# EAGLE design lightmeter_5_ATTiny84 (EAGLE 9.6.2)
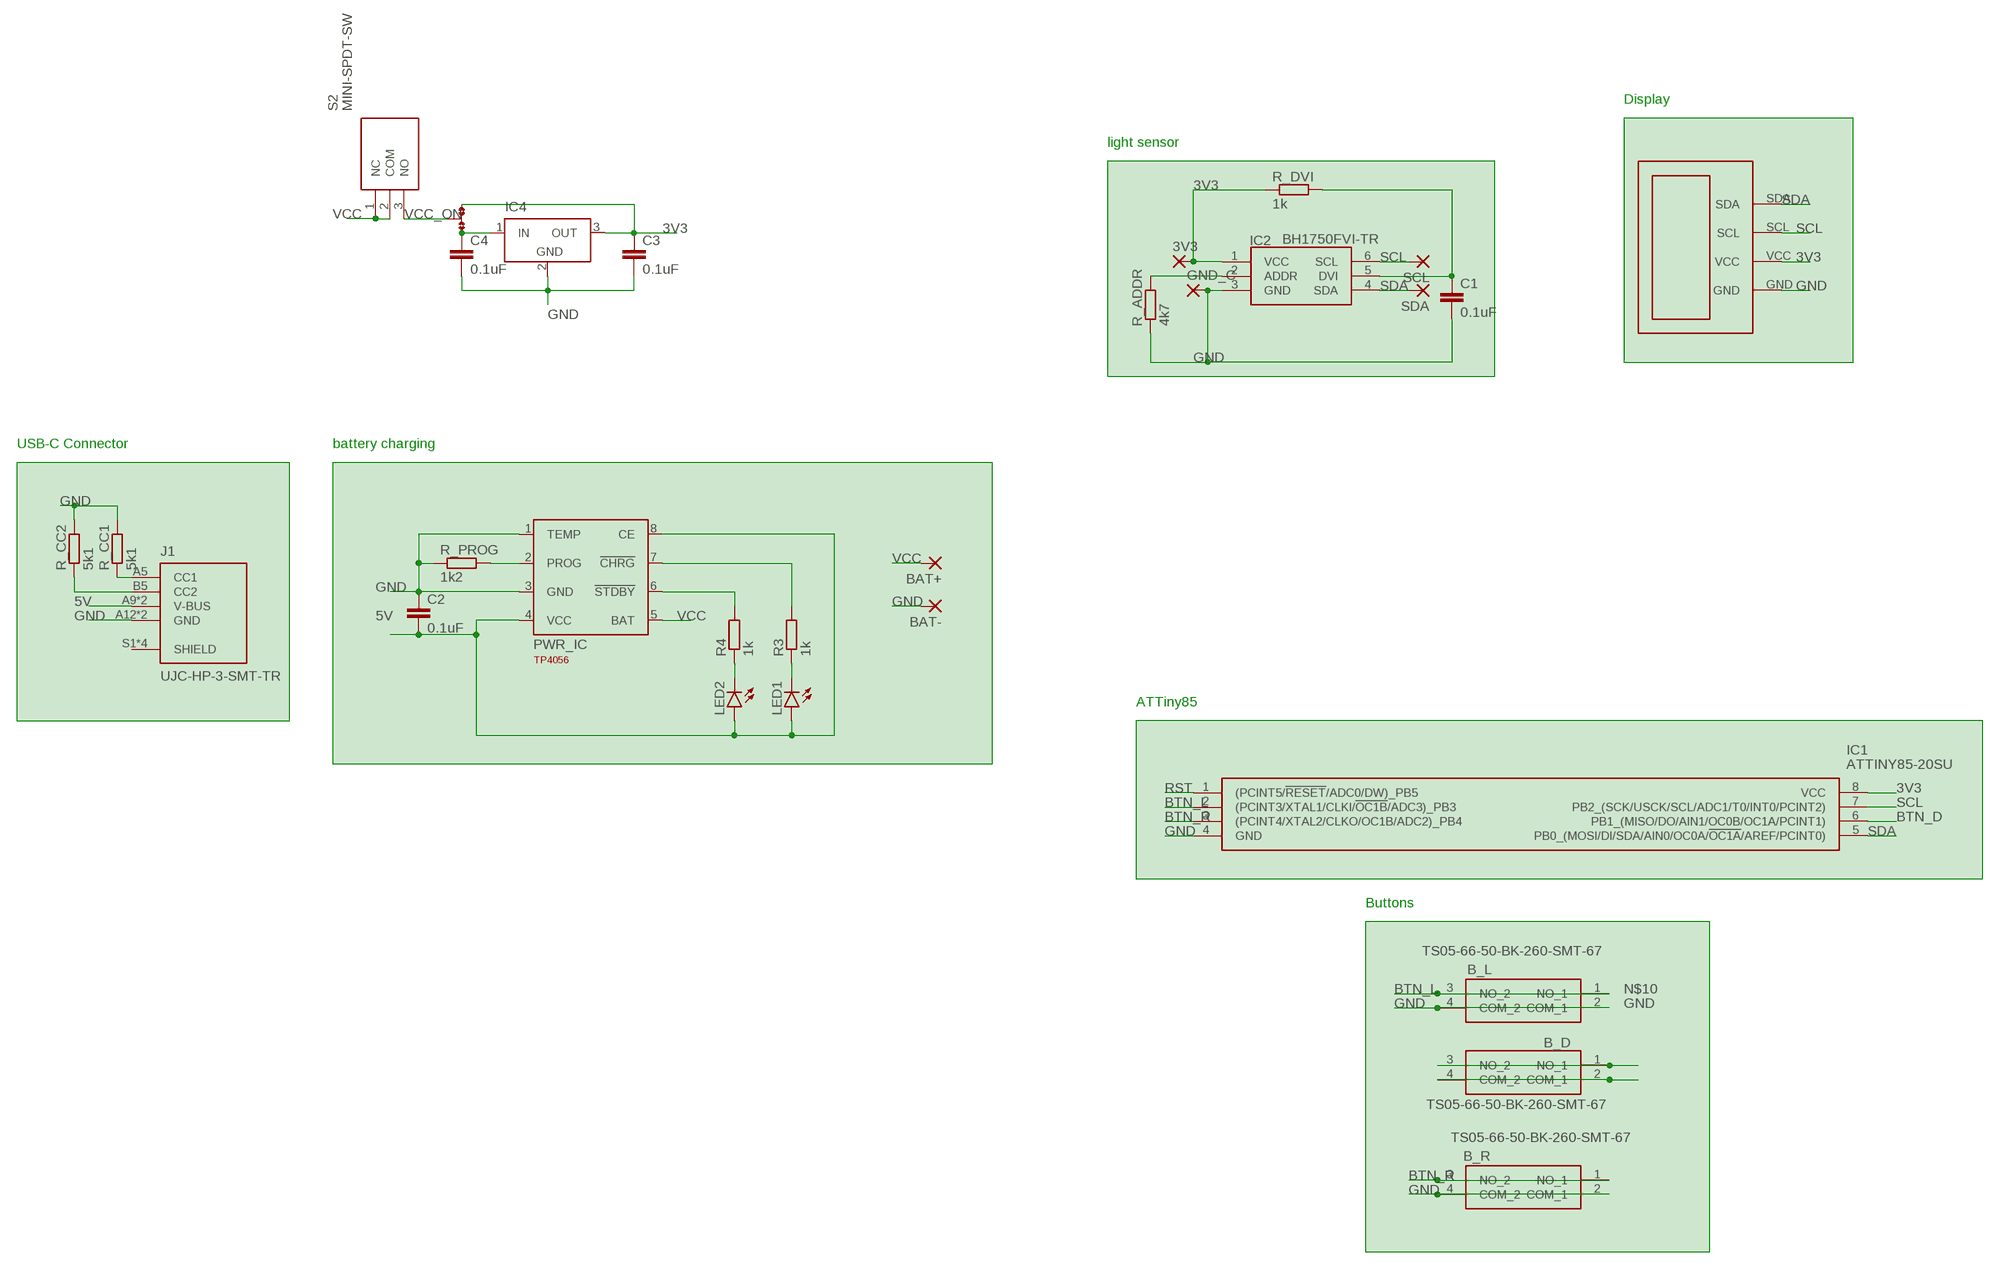
[diagram p0: schematic, sheet 1]

## Parts
3V3  1,6/0,8  [1,6/0,8]
B_D  TS05-66-50-BK-260-SMT-67  [TS056650BK260SMT67]
B_L  TS05-66-50-BK-260-SMT-67  [TS056650BK260SMT67]
B_R  TS05-66-50-BK-260-SMT-67  [TS056650BK260SMT67]
BAT+  WIREPADSMD1,27-254  [SMD1,27-2,54]
BAT-  WIREPADSMD1,27-254  [SMD1,27-2,54]
C1  0.1uF  C-EUC0805K  [C0805K]
C2  0.1uF  C-EUC0805K  [C0805K]
C3  0.1uF  C-EUC0805K  [C0805K]
C4  0.1uF  C-EUC0805K  [C0805K]
GND_C  1,6/0,8  [1,6/0,8]
IC1  ATTINY85-20SU  [SOIC127P798X216-8N]
IC2  BH1750FVI-TR  [WSOF6]
IC4  LT1129CST5  [SOT223]
J1  UJC-HP-3-SMT-TR  [CUI_UJC-HP-3-SMT-TR]
JMP1  0R-JUMPB  [B0R-JMP]
LED1  LEDCHIPLED_1206  [CHIPLED_1206]
LED2  LEDCHIPLED_1206  [CHIPLED_1206]
PWR_IC  TP4056  [SOT23-8]
R3  1k  R-EU_R0805  [R0805]
R4  1k  R-EU_R0805  [R0805]
R_ADDR  4k7  R-EU_R0805  [R0805]
R_CC1  5k1  R-EU_R0805  [R0805]
R_CC2  5k1  R-EU_R0805  [R0805]
R_DVI  1k  R-EU_R0805  [R0805]
R_PROG  1k2  R-EU_R0805  [R0805]
S2  MINI-SPDT-SW  [MINISPDTSW]
SCL  1,6/0,8  [1,6/0,8]
SDA  1,6/0,8  [1,6/0,8]
U$1  I2C_OLED_128X64  [I2C_OLED_128X64_BREAKOUT]

## Nets
3V3: 3V3.1(P) C3.1 IC1.8(VCC) IC2.1(VCC) IC4.3(OUT) JMP1.3 R_DVI.1 U$1.VCC
5V: C2.2 J1.A9(V-BUS) J1.B9(V-BUS) LED1.A LED2.A PWR_IC.4(VCC) PWR_IC.8(CE)
BTN_D: IC1.6(PB1_(MISO/DO/AIN1/OC0B/OC1A/PCINT1))
BTN_L: B_L.1(NO_1) B_L.3(NO_2) IC1.2((PCINT3/XTAL1/CLKI/!OC1B!/ADC3)_PB3)
BTN_R: B_R.1(NO_1) B_R.3(NO_2) IC1.3((PCINT4/XTAL2/CLKO/OC1B/ADC2)_PB4)
GND: B_D.2(COM_1) B_D.4(COM_2) B_L.2(COM_1) B_L.4(COM_2) B_R.2(COM_1) B_R.4(COM_2) BAT-.1(P) C1.2 C2.1 C3.2 C4.2 GND_C.1(P) IC1.4(GND) IC2.3(GND) IC4.2(GND) J1.A12(GND) J1.B12(GND) PWR_IC.1(TEMP) PWR_IC.3(GND) R_ADDR.1 R_CC1.2 R_CC2.2 R_PROG.1 U$1.GND
N$1: C1.1 IC2.5(DVI) R_DVI.2
N$2: IC2.2(ADDR) R_ADDR.2
N$3: J1.B5(CC2) R_CC2.1
N$4: PWR_IC.6(!STDBY) R4.2
N$5: PWR_IC.7(!CHRG) R3.2
N$6: LED2.C R4.1
N$7: LED1.C R3.1
N$8: J1.A5(CC1) R_CC1.1
N$9: PWR_IC.2(PROG) R_PROG.2
N$10: B_D.1(NO_1) B_D.3(NO_2)
N$11: C4.1 IC4.1(IN) JMP1.1
RST: IC1.1((PCINT5/!RESET!/ADC0/DW)_PB5)
SCL: IC1.7(PB2_(SCK/USCK/SCL/ADC1/T0/INT0/PCINT2)) IC2.6(SCL) SCL.1(P) U$1.SCL
SDA: IC1.5(PB0_(MOSI/DI/SDA/AIN0/OC0A/!OC1A!/AREF/PCINT0)) IC2.4(SDA) SDA.1(P) U$1.SDA
VCC: BAT+.1(P) PWR_IC.5(BAT) S2.1(NC) S2.2(COM)
VCC_ON: JMP1.2 S2.3(NO)
Unconnected: J1.S1(SHIELD) J1.S2(SHIELD) J1.S3(SHIELD) J1.S4(SHIELD)

## Notes on the sheet
- Display
- light sensor
- USB-C Connector | battery charging
- ATTiny85
- Buttons

## Power pins joined to a net without a drawn wire
GND: IC4.4(GND)

## Library data of the parts
3V3 GND_C SCL SDA = wirepad:1,6/0,8: THROUGH-HOLE PAD
B_D B_L B_R = SamacSys_Parts:TS05-66-50-BK-260-SMT-67: Tactile Switches 6 x 6 mm, 5 mm Act Height, 260 gf, Black, Surface Mount, IP67, SPST, Source: Datasheet <https://www.cuidevices.com/product/resource/ts05.pdf>; DESCRIPTION: Tactile Switches 6 x 6 mm, 5 mm Act Height, 260 gf, Black, Surface Mount, IP67, SPST,; HEIGHT: 5.2mm; MANUFACTURER_NAME: CUI Inc.; MANUFACTURER_PART_NUMBER: TS05-66-50-BK-260-SMT-67; MOUSER_PART_NUMBER: 179-TS056650260SMT67; MOUSER_PRICE-STOCK: https://www.mouser.co.uk/ProductDetail/CUI-Devices/TS05-66-50-BK-260-SMT-67?qs=A6eO%252BMLsxmTTpMlvA87NHQ%3D%3D
BAT+ BAT- = wirepad:WIREPAD: Wire PAD connect wire on PCB
C1-C4 = rcl:C-EU: CAPACITOR, European symbol; SPICEPREFIX: C
IC1 = SamacSys_Parts:ATTINY85-20SU: MICROCHIP - ATTINY85-20SU - MICROCONTROLLER MCU, 8 BIT, ATTINY, 20MHZ, SOIC-8 Source: Datasheet <https://componentsearchengine.com/Datasheets/2/ATTINY85-20SU.pdf>; DESCRIPTION: MICROCHIP - ATTINY85-20SU - MICROCONTROLLER MCU, 8 BIT, ATTINY, 20MHZ, SOIC-8; HEIGHT: 2.16mm; MANUFACTURER_NAME: Microchip; MANUFACTURER_PART_NUMBER: ATTINY85-20SU; MOUSER_PART_NUMBER: 556-ATTINY85-20SU; MOUSER_PRICE-STOCK: https://www.mouser.co.uk/ProductDetail/Microchip-Technology-Atmel/ATTINY85-20SU?qs=8jWQYweyg6N%2FGXnwAe4Icw%3D%3D
IC2 = SamacSys_Parts:BH1750FVI-TR: Ambient Light Sensor,16bit,I2C,WSOF6I ROHM BH1750FVI-TR Ambient Light Sensor Unit Surface Mount Source: Datasheet <https://componentsearchengine.com/Datasheets/2/BH1750FVI-TR.pdf>; DESCRIPTION: Ambient Light Sensor,16bit,I2C,WSOF6I ROHM BH1750FVI-TR Ambient Light Sensor Unit Surface Mount; HEIGHT: mm; MANUFACTURER_NAME: ROHM Semiconductor; MANUFACTURER_PART_NUMBER: BH1750FVI-TR; MOUSER_PART_NUMBER: 755-BH1750FVI-TR; MOUSER_PRICE-STOCK: https://www.mouser.co.uk/ProductDetail/ROHM-Semiconductor/BH1750FVI-TR?qs=phc6PQ%252BTPUNy88lRCs6mVA%3D%3D
IC4 = linear-technology:LT1129CST5: VOLTAGE REGULATOR with shutdown; MPN: LT1129CST-5#PBF; OC_FARNELL: 1663375; OC_NEWARK: 57M2069
J1 = UJC-HP-3-SMT-TR:UJC-HP-3-SMT-TR: Type C, 3 A, Right Angle, Surface Mount (SMT), Power-Only USB Receptacle Check availability <https://pricing.snapeda.com/parts/UJC-HP-3-SMT-TR/CUI%20Devices/view-part?ref=eda>; AVAILABILITY: In Stock; CUI_PURCHASE_URL: https://www.cuidevices.com/product/interconnect/connectors/usb-connectors/ujc-hp-3-smt-tr?utm_source=snapeda.com&utm_medium=referral&utm_campaign=snapedaBOM; DESCRIPTION: Type C, 3 A, Right Angle, Surface Mount (SMT), Power-Only USB Receptacle; MF: CUI Devices; MP: UJC-HP-3-SMT-TR; PACKAGE: None; PRICE: None; PURCHASE-URL: https://pricing.snapeda.com/search/part/UJC-HP-3-SMT-TR/?ref=eda
JMP1 = jump-0r-smd:0R-JUMP: SMD 0R 0805 Jumper
LED1 LED2 = led:LED: LED OSRAM: - CHIPLED LG R971, LG N971, LY N971, LG Q971, LY Q971, LO R971, LY R971 LH N974, LH R974 LS Q976, LO Q976, LY Q976 LO Q996 - Hyper CHIPLED LW Q18S LB Q993, LB Q99A, LB R99A - SideLED LS A670, LO A670, LY A670, LG A670, LP A670 LB A673, LV A673, LT A673, LW A673 LH A674 LY A675 LS A676, LA A676, LO A676, LY A676, LW A676 LS A679, LY A679, LG A679 - Hyper Micro SIDELED® LS Y876, LA Y876, LO Y876, LY Y876 LT Y87S - SmartLED LW L88C, LW L88S LB L89C, LB L89S, LG L890 LS L89K, LO L89K, LY L89K LS L896, LA L896, LO L896, LY L896 - TOPLED LS T670, LO T670, LY T670, LG T670, LP T670 LSG T670, LSP T670, LSY T670, LOP T670, LYG T670 LG T671, LOG T671, LSG T671 LB T673, LV T673, LT T673, LW T673 LH T674 LS T676, LA T676, LO T676, LY T676, LB T676, LH T676, LSB T676, LW T676 LB T67C, LV T67C, LT T67C, LS T67K, LO T67K, LY T67K, LW E67C LS E67B, LA E67B, LO E67B, LY E67B, LB E67C, LV E67C, LT E67C LW T67C LS T679, LY T679, LG T679 LS T770, LO T770, LY T770, LG T770, LP T770 LB T773, LV T773, LT T773, LW T773 LH T774 LS E675, LA E675, LY E675, LS T675 LS T776, LA T776, LO T776, LY T776, LB T776 LHGB T686 LT T68C, LB T68C - Hyper Mini TOPLED® LB M676 - Mini TOPLED Santana® LG M470 LS M47K, LO M47K, LY M47K Source: http://www.osram.convergy.de LUXEON: - LUMILED® LXK2-PW12-R00, LXK2-PW12-S00, LXK2-PW14-U00, LXK2-PW14-V00 LXK2-PM12-R00, LXK2-PM12-S00, LXK2-PM14-U00 LXK2-PE12-Q00, LXK2-PE12-R00, LXK2-PE12-S00, LXK2-PE14-T00, LXK2-PE14-U00 LXK2-PB12-K00, LXK2-PB12-L00, LXK2-PB12-M00, LXK2-PB14-N00, LXK2-PB14-P00, LXK2-PB14-Q00 LXK2-PR12-L00, LXK2-PR12-M00, LXK2-PR14-Q00, LXK2-PR14-R00 LXK2-PD12-Q00, LXK2-PD12-R00, LXK2-PD12-S00 LXK2-PH12-R00, LXK2-PH12-S00 LXK2-PL12-P00, LXK2-PL12-Q00, LXK2-PL12-R00 Source: www.luxeon.com KINGBRIGHT: KA-3528ASYC Source: www.kingbright.com
PWR_IC = tp4056:TP4056: TP4056 Data sheet <http://goo.gl/J7k8TF> Dave.Calaway Eagle Library <https://goo.gl/Muy1Tr>
R3 R4 R_ADDR R_CC1 R_CC2 R_DVI R_PROG = rcl:R-EU_: RESISTOR, European symbol; SPICEPREFIX: R
S2 = SamacSys_Parts:MINI-SPDT-SW: Slide Switches MINI SPDT SWITCH Source: Datasheet <http://site.gravitech.us/Components/MINI-SPDT-SW/EG1218_datasheet.pdf>; DESCRIPTION: Slide Switches MINI SPDT SWITCH; HEIGHT: mm; MANUFACTURER_NAME: Gravitech; MANUFACTURER_PART_NUMBER: MINI-SPDT-SW; MOUSER_PART_NUMBER: 992-MINI-SPDT-SW; MOUSER_PRICE-STOCK: https://www.mouser.co.uk/ProductDetail/Gravitech/MINI-SPDT-SW?qs=Vxac6xGyzPm8ENq695r3yA%3D%3D
U$1 = my_breakouts:I2C_OLED_128X64

## Board
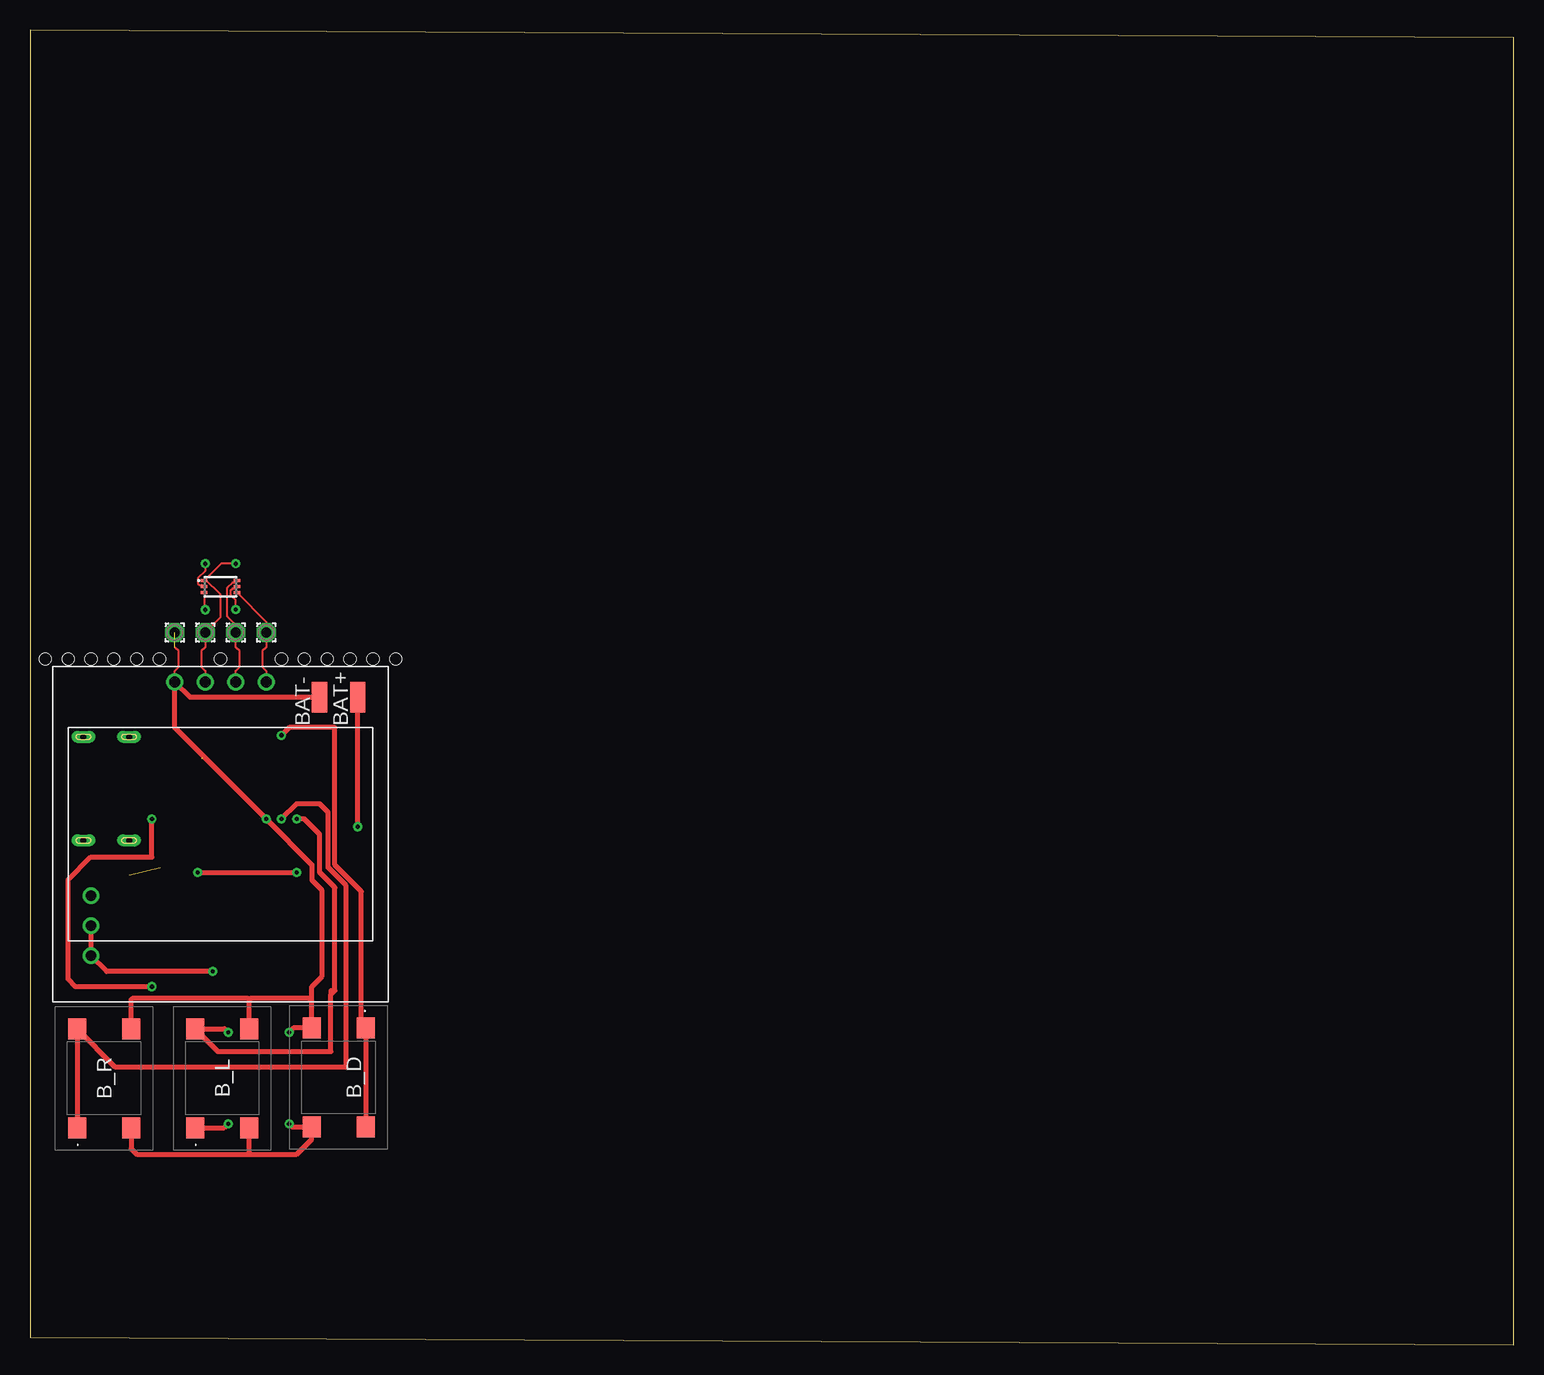
[diagram p1: board, top side]
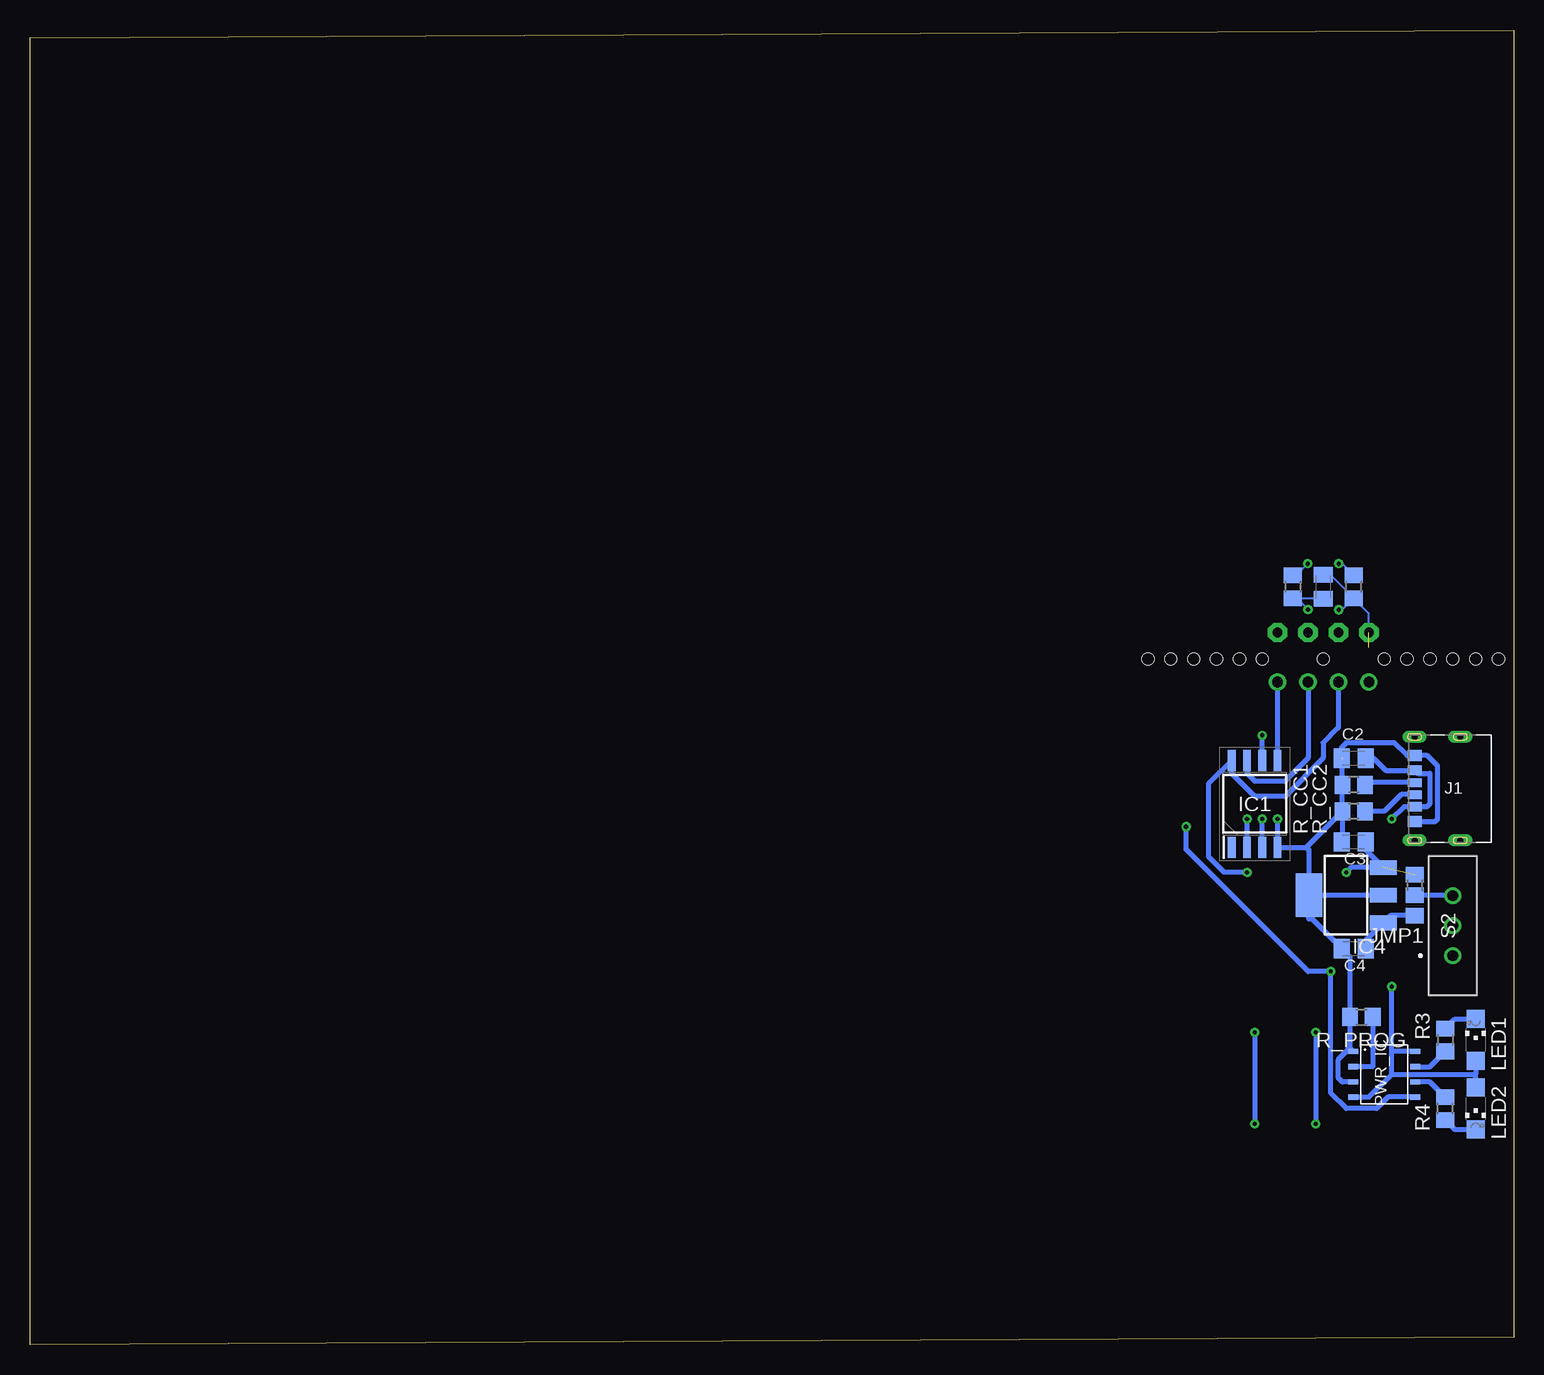
[diagram p2: board, bottom side, seen from below]

Size 123.64 x 109.59 mm. Coordinates in mm from the lower left corner, seen from the top.
Outline: 0,0.64 123.64,0 123.64,108.96 0,109.59 0,0.64
Copper layers (1*16): Top 0.035mm / dielectric 1.5mm / Bottom 0.035mm
Design rules "default": minimum track width 6mil, minimum drill 0.35mm, track to track 6mil, track to pad 6mil, pad to pad 6mil, via to via 6mil, smd to smd 6mil, copper to edge 40mil, drill to drill 6mil, minimum pad ring 10mil, minimum via ring 8mil, stop-mask expansion 4mil, vias tented up to drill 0mil, thermal gap 10mil
Holes 1 mm at 1.27,57.15 3.17,57.15 5.08,57.15 6.99,57.15 8.89,57.15 10.79,57.15 15.88,57.15 20.96,57.15 22.86,57.15 24.77,57.15 26.67,57.15 28.58,57.15 30.48,57.15

### Footprints (pad centres in the part's own frame; a part is rotated, then mirrored left to right if it is on the bottom)
1,6/0,8 = drill 0.813 pad 1.6 octagon: 1 0,0
TS056650BK260SMT67 = smd 1.75 x 1.5: 1 -4.125,2.25; 2 -4.125,-2.25; 3 4.125,2.25; 4 4.125,-2.25
SMD1,27-2,54 = smd 1.27 x 2.54: 1 0,0
C0805K = smd 1.3 x 1.6: 1 -1,0; 2 1,0
SOIC127P798X216-8N = smd 1.75 x 0.65: 1 -3.625,1.905; 2 -3.625,0.635; 3 -3.625,-0.635; 4 -3.625,-1.905; 5 3.625,-1.905; 6 3.625,-0.635; 7 3.625,0.635; 8 3.625,1.905
WSOF6 = smd 0.55 x 0.25: 1 -1.375,0.5; 2 -1.375,0; 3 -1.375,-0.5; 4 1.375,-0.5; 5 1.375,0; 6 1.375,0.5
SOT223 = smd 1.219 x 2.235: 1 -2.311,-3.099; 2 0,-3.099; 3 2.311,-3.099 | smd 3.6 x 2.2: 4 0,3.099
CUI_UJC-HP-3-SMT-TR = smd 0.7 x 1.15: A5 -0.5,0.005; B5 0.5,0.005 | smd 0.8 x 1.15: A9 1.52,0.005; B9 -1.52,0.005 | smd 0.9 x 1.15: A12 2.75,0.005; B12 -2.75,0.005 | drill 0.5 pad 1 long: S1 -4.32,0; S2 4.32,0; S3 -4.32,-3.8; S4 4.32,-3.8
B0R-JMP = smd 1.5 x 1.3: 1 0,1.7; 2 0,0; 3 0,-1.7
CHIPLED_1206 = smd 1.5 x 1.5: A 0,-1.75; C 0,1.75
SOT23-8 = smd 0.42 x 0.835: 1 -1.905,-2.58; 2 -0.635,-2.58; 3 0.635,-2.58; 4 1.905,-2.58; 5 1.905,2.58; 6 0.635,2.58; 7 -0.635,2.58; 8 -1.905,2.58
R0805 = smd 1.3 x 1.5: 1 -0.95,0; 2 0.95,0
MINISPDTSW = drill 0.9 pad 1.4: 1 -2.5,0; 2 0,0; 3 2.5,0
I2C_OLED_128X64_BREAKOUT = drill 0.9 pad 1.422: GND -10.16,1.27; SCL -15.24,1.27; SDA -17.78,1.27; VCC -12.7,1.27

### Placement (x,y rotation side)
3V3  14.6,59.37 0 top
B_D  25.71,22.27 270 top
B_L  16.02,22.21 90 top
B_R  6.17,22.21 90 top
BAT+  27.3,53.97 0 top
BAT-  24.13,53.97 0 top
C1  15.88,63.18 90 bottom
C2  13.33,48.89 0 bottom
C3  13.33,41.91 180 bottom
C4  13.33,33.02 180 bottom
GND_C  12.06,59.37 0 top
IC1  21.59,45.09 90 bottom
IC2  15.88,63.18 0 top
IC4  13.97,37.46 90 bottom
J1  8.25,46.35 90 bottom
JMP1  8.25,37.46 180 bottom
LED1  3.17,25.4 0 bottom
LED2  3.17,19.69 180 bottom
PWR_IC  10.79,22.54 270 bottom
R3  5.71,25.4 270 bottom
R4  5.71,19.69 90 bottom
R_ADDR  13.33,63.18 90 bottom
R_CC1  13.33,44.45 180 bottom
R_CC2  13.33,46.67 180 bottom
R_DVI  18.42,63.18 270 bottom
R_PROG  12.7,27.3 0 bottom
S2  5.08,34.92 90 bottom
SCL  17.14,59.37 0 top
SDA  19.69,59.37 0 top
U$1  1.91,56.52 180 top

### Tracks (layer width: path | path; a pad name or v marks a point on that pad's centre or on a via)
3V3  (via drill 0.35)  (1 unrouted)
  Top 0.152: v17.16,65.1 15.92,65.1 14.62,63.8 | 14.62,63.8 IC2.1 | 14.62,63.8 14.62,63.79 15.83,62.57 15.83,60.6 3V3.1 14.6,58.13 14.28,57.81 14.28,56.49 14.6,56.17 U$1.VCC
  Top 0.406: v13.97,39.37 v22.23,39.37
  Bottom 0.152: R_DVI.1 18.12,64.13 v17.16,65.1
  Bottom 0.203: R_DVI.1 18.42,64.45
  Bottom 0.406: 14.6,54.61 U$1.VCC 14.6,51.43 15.88,50.16 15.88,48.89 19.05,45.72 21.59,45.72 23.5,47.62 IC1.8 25.4,46.8 25.4,40.64 24.13,39.37 v22.23,39.37 | C3.1 12.33,41.24 IC4.3 13.56,39.78 v13.97,39.37
5V  (via drill 0.35)
  Top 0.406: v10.16,29.85 3.81,29.85 3.17,30.48 3.17,38.73 5.08,40.64 10.16,40.64 v10.16,43.81
  Bottom 0.406: LED2.A 3.17,22.54 | LED1.A 3.17,22.54 | C2.2 11.7,48.89 10.68,47.88 J1.A9 8.01,47.62 6.99,47.62 6.99,45.09 7.24,44.84 J1.B9 9.14,44.84 v10.16,43.81 | 10.16,22.54 3.17,22.54 | 10.16,22.54 10.16,24.45 | PWR_IC.8 10.16,24.45 | PWR_IC.4 12.06,20.64 10.16,22.54 | 10.16,24.45 v10.16,29.85
BTN_D  (via drill 0.35)
  Top 0.406: v20.96,50.8 21.59,51.43 25.4,51.43 25.4,40 27.62,37.78 27.62,26.74
  Bottom 0.406: IC1.6 v20.96,50.8
BTN_L  (via drill 0.35)
  Top 0.406: 25.08,29.21 25.08,24.45 15.65,24.45 B_L.3 16.21,26.34 v16.51,26.04 | 25.08,29.53 25.08,29.21 | 25.08,29.21 25.4,29.53 25.4,38.1 24.13,39.37 24.13,42.54 22.86,43.81 v22.23,43.81 | B_L.1 16.18,18.09 v16.51,18.42
  Bottom 0.406: IC1.2 v22.23,43.81 | v16.51,26.04 v16.51,18.42
BTN_R  (via drill 0.35)
  Top 0.406: v20.96,43.81 22.23,45.09 24.13,45.09 24.84,44.37 24.84,39.77 26.35,38.26 26.35,23.18 7.08,23.18 B_R.3 B_R.1
  Bottom 0.406: IC1.3 v20.96,43.81
GND  (via drill 0.35)  (2 unrouted)
  Top 0.152: IC2.3 14.5,61.36 v14.59,61.27 | U$1.GND 12.06,56.17 12.39,56.49 12.39,57.81 12.06,58.13
  Top 0.406: B_R.4 8.42,28.74 8.57,28.89 18.1,28.89 18.27,28.72 | B_L.4 18.27,28.72 | 23.46,28.61 23.18,28.89 18.43,28.89 18.27,28.72 | 23.46,28.61 B_D.2 21.95,26.4 v21.59,26.04 | 23.46,28.61 23.46,29.81 24.31,30.66 24.31,37.92 23.5,38.73 23.5,40 v19.69,43.81 12.06,51.43 U$1.GND 13.33,53.97 BAT-.1 | B_R.2 8.42,16.34 8.89,15.87 18.42,15.87 | 18.42,15.87 22.23,15.87 23.46,17.11 B_D.4 21.86,18.15 v21.59,18.42 | 18.42,15.87 18.27,16.03 B_L.2
  Bottom 0.152: R_ADDR.1 15.29,64.18 C1.2 | GND_C.1 12.06,60.96 R_ADDR.1 | R_ADDR.1 14.3,61.27 v14.59,61.27
  Bottom 0.406: PWR_IC.1 13.65,24.72 | 13.65,24.72 R_PROG.1 13.65,32.34 C4.2 16.8,35.48 17.07,35.48 IC4.4 | PWR_IC.3 14.29,21.91 14.6,22.23 14.6,23.77 13.65,24.72 | J1.B12 8.33,43.53 | 8.15,43.5 J1.B12 | J1.B12 6.56,43.6 6.35,43.81 6.35,48.26 7.2,49.1 J1.A12 8.89,49.1 9.96,50.16 13.97,50.16 14.33,49.8 C2.1 | R_CC1.2 R_CC2.2 14.29,48.84 | v19.69,43.81 IC1.4 17.27,41.46 | v21.59,26.04 v21.59,18.42 | R_CC1.2 17.27,41.46 | 17.27,41.46 17.07,41.25 IC4.4 | IC4.2 IC4.4 | R_CC1.2 14.29,41.96 C3.2
N$1  (via drill 0.35)
  Top 0.152: v17.14,61.28 17.14,62.06 16.75,62.46 16.75,62.9 16.88,63.04 17.1,63.04 IC2.5
  Bottom 0.152: C1.1 18.37,62.18 R_DVI.2 18.1,62.23 v17.14,61.28
N$2  (via drill 0.35)
  Top 0.152: v14.59,65.1 14.59,64.5 14,63.9 14,63.46 14.13,63.33 14.35,63.33 IC2.2
  Bottom 0.152: R_ADDR.2 14.3,65.1 v14.59,65.1
N$3
  Bottom 0.406: J1.B5 12.2,46.85 R_CC2.1
N$4
  Bottom 0.406: R4.2 6.99,21.91 PWR_IC.6
N$5
  Bottom 0.406: PWR_IC.7 6.99,23.18 R3.2
N$6
  Bottom 0.406: R4.1 4.92,17.94 LED2.C
N$7
  Bottom 0.406: R3.1 4.92,27.15 LED1.C
N$8
  Bottom 0.406: J1.A5 9.39,45.85 10.79,44.45 R_CC1.1
N$9
  Bottom 0.406: R_PROG.2 11.75,23.18 PWR_IC.2
N$10
  Top 0.406: B_D.1 B_D.3
N$11
  Bottom 0.406: JMP1.1 10.26,35.77 IC4.1 12.33,33.69 C4.1
SCL
  Top 0.152: IC2.6 17.1,63.54 16.88,63.54 16.44,63.1 16.44,60.71 17.14,60.01 SCL.1 17.14,58.13 17.47,57.81 17.47,56.49 17.14,56.17 U$1.SCL
  Bottom 0.406: IC1.7 22.23,47.62 21.59,46.99 19.05,46.99 17.14,48.89 U$1.SCL
SDA
  Top 0.152: IC2.4 19.69,60.25 SDA.1 19.69,58.13 19.36,57.81 19.36,56.49 19.69,56.17 U$1.SDA
  Bottom 0.406: IC1.5 U$1.SDA
VCC  (via drill 0.35)
  Top 0.406: v15.24,31.11 6.39,31.11 S2.1 S2.2 | v27.3,43.18 BAT+.1
  Bottom 0.406: PWR_IC.5 10.48,20.64 11.43,19.69 13.97,19.69 15.24,20.96 v15.24,31.11 17.14,31.11 27.3,41.27 v27.3,43.18
VCC_ON
  Bottom 0.406: S2.3 5.12,37.46 JMP1.2